# Altium schematic sheet MAGI'sBoostPowerV2.SchDoc
size A4
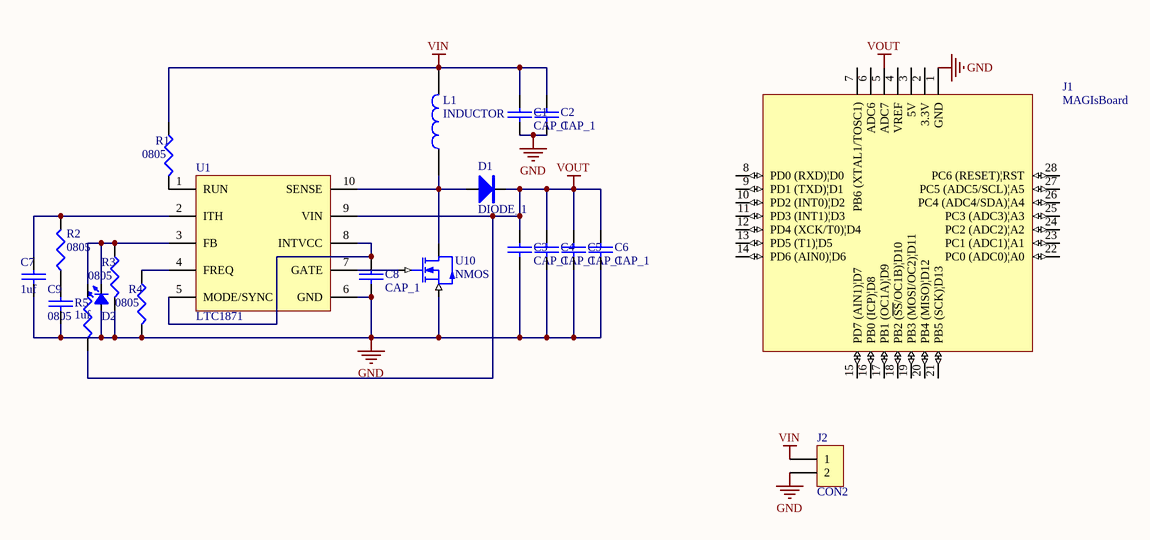
[diagram p0: MAGI'sBoostPowerV2.SchDoc]

## Parts
C1  CAP_1  [C1206]
C2  CAP_1  [C1206]
C3  CAP_1  [C1210_N]
C4  CAP_1  [C1210_N]
C5  CAP_1  [C1206]
C6  CAP_1  [C1206]
C7  1uf  [6-0805_N]
C8  CAP_1  [6-0805_n]
C9  1uf  [6-0805_N]
D1  DIODE_1  [SMB]
D2  LED_0805  [6-0805_n]  (value not drawn)
J1  MAGIsBoard  [MAGIsBoard]
J2  CON2  [T-Mini]
L1  INDUCTOR  [10*10]
R1  0805  [6-0805_N]
R2  0805  [6-0805_N]
R3  0805  [6-0805_N]
R4  0805  [6-0805_N]
R5  0805  [6-0805_N]
U1  LTC1871  [LTC1871]
U10  NMOS  [AOD4184]

## Nets
GND: C1.2 C2.1 C3.1 C4.1 C5.1 C6.1 C7.1 C8.1 C9.1 D2.1(A) J1.1(GND) J2.2 R3.2 R4.2 U1.6(GND) U10.3(S)
VIN: C1.1 C2.2 J2.1 L1.2 R1.1
VOUT: C3.2 C4.2 C5.2 C6.2 D1.2(K) J1.5(ADC7) R5.2 U1.9(VIN)
NetC7_2: C7.2 R2.2 U1.2(ITH)
NetC8_2: C8.2 U1.5(MODE/SYNC) U1.8(INTVCC)
NetC9_2: C9.2 R2.1
NetD1_1: D1.1(A) L1.1 U1.10(SENSE) U10.4(D)
NetD2_2: D2.2(K) R3.1 R5.1 U1.3(FB)
NetR1_2: R1.2 U1.1(RUN)
NetR4_1: R4.1 U1.4(FREQ)
NetU1_7: U1.7(GATE) U10.1(G)

Not connected (* = marked no-connect by the designer): J1 2(3.3V) 3(5V) 4(VREF) 6(ADC6) 7(PB6_(XTAL1/TOSC1)) 8(PD0_(RXD)|D0) 9(PD1_(TXD)|D1) 10(PD2_(INT0)|D2) 11(PD3_(INT1)|D3) 12(PD4_(XCK/T0)|D4) 13(PD5_(T1)|D5) 14(PD6_(AIN0)|D6) 15(PD7_(AIN1)|D7) 16(PB0_(ICP)|D8) 17(PB1_(OC1A)|D9) 18(PB2_(~{SS}/OC1B)|D10) 19(PB3_(MOSI/OC2)|D11) 20(PB4_(MISO)|D12) 21(PB5_(SCK)|D13) 22(PC0_(ADC0)|A0) 23(PC1_(ADC1)|A1) 24(PC2_(ADC2)|A2) 25(PC3_(ADC3)|A3) 26(PC4_(ADC4/SDA)|A4) 27(PC5_(ADC5/SCL)|A5) 28(PC6_(RESET)|RST)

## Library data of the parts
C1-C9 = CAP_1: Capacitor
D1 = DIODE_1: Diode
D2 = LED_0805: LED
J2 = CON2: Connector
R1-R5 = RES1_1
U10 = NMOS: TO252